# EAGLE design wander-v1.1 (EAGLE 9.4.2)
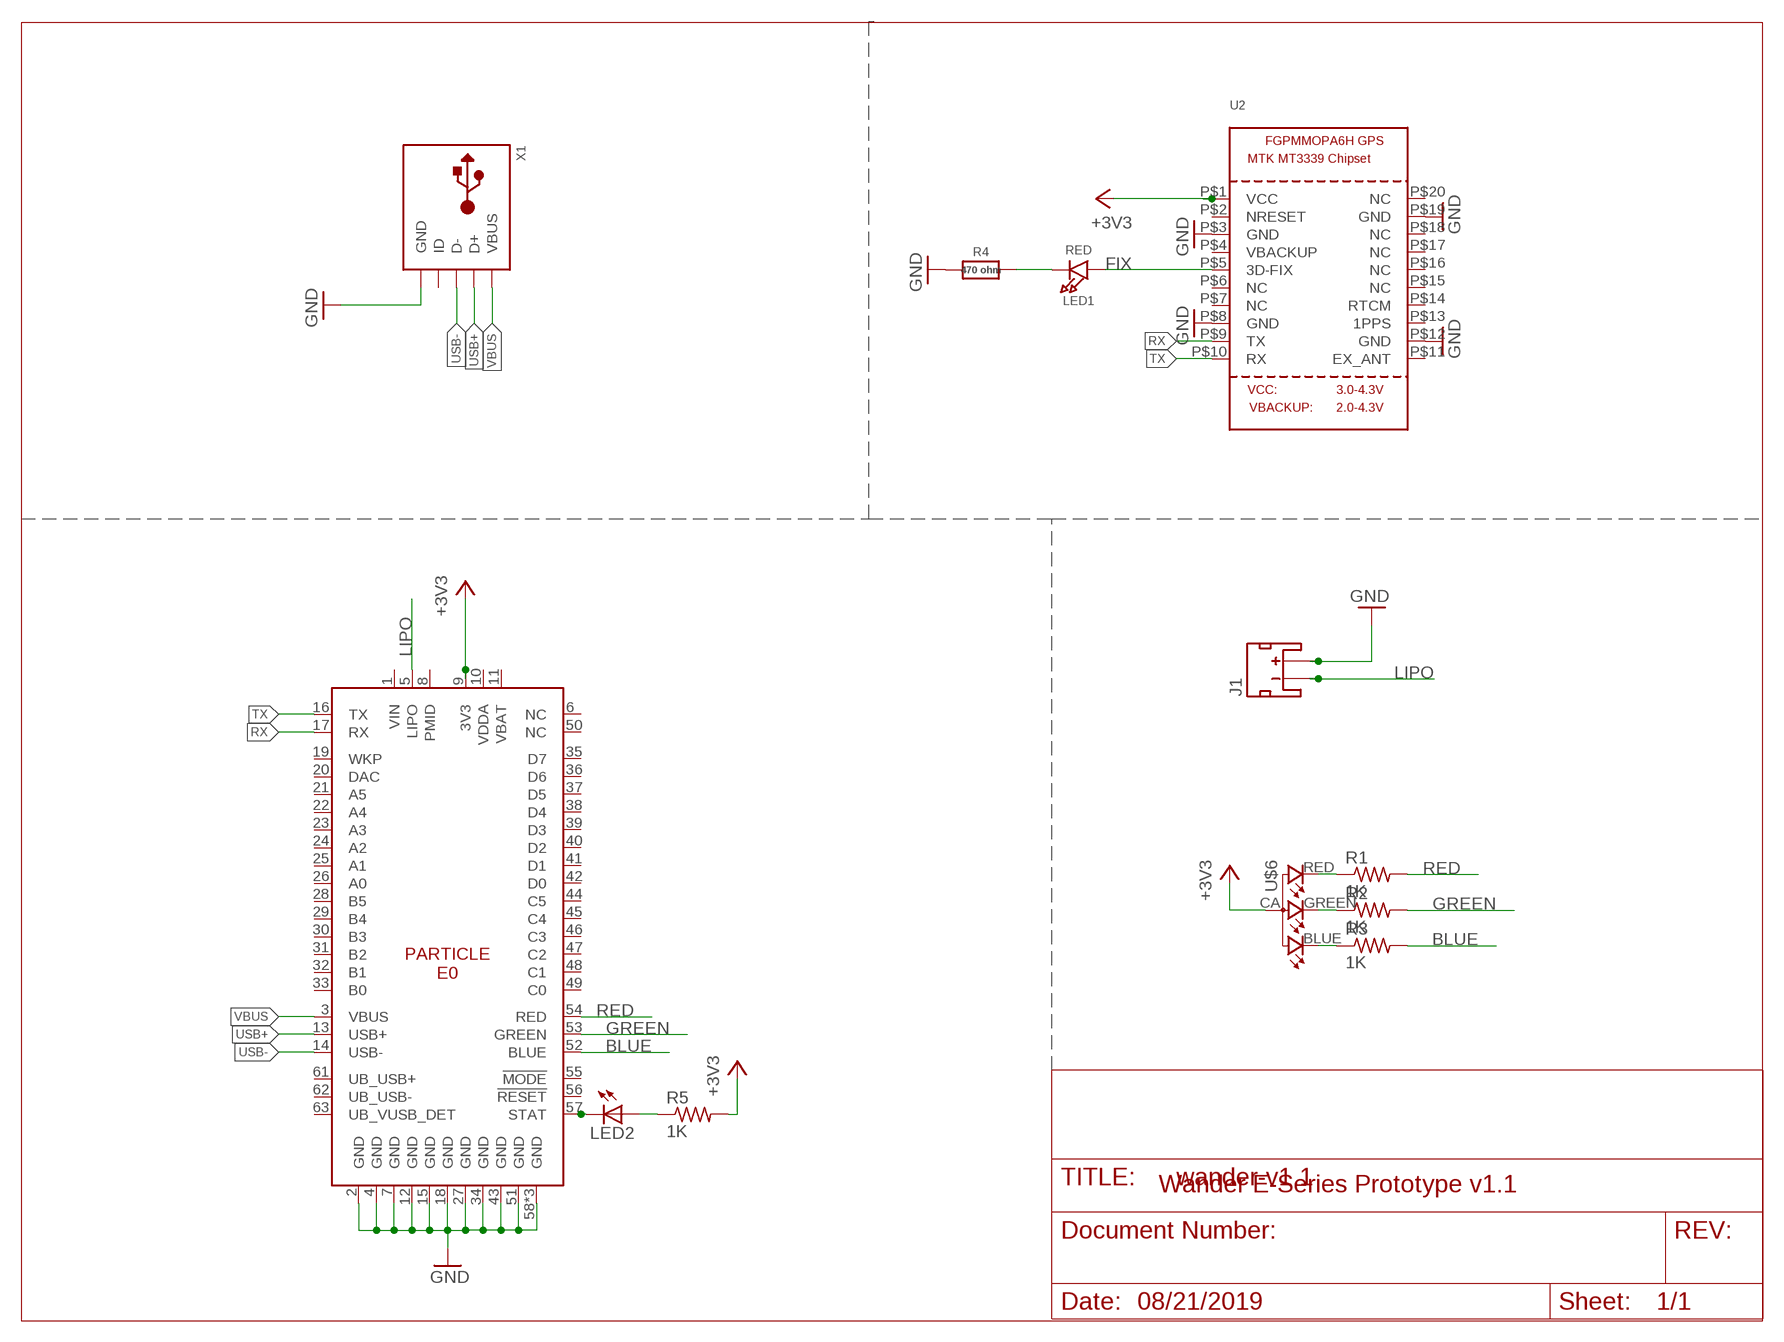
[diagram p0: schematic, sheet 1]

## Parts
J1  JST_2MM_MALE  [JST-2-SMD]
LED1  RED  LED0805_NOOUTLINE  [CHIPLED_0805_NOOUTLINE]
LED2  LED0603  [LED-0603]
R1  1K  R-US_R0603  [R0603]
R2  1K  R-US_R0603  [R0603]
R3  1K  R-US_R0603  [R0603]
R4  470 ohm  RESISTOR0805_NOOUTLINE  [0805-NO]
R5  1K  R-US_R0603  [R0603]
U1  E0_V005  [E0]
U2  GPS_FGPMMOPA6H  [FGPMMOPA6H]
U$6  RGB-LED-CLMVB-FKARGB  [PLCC4-2MM-RGB]
X1  USB-NEW-PHOTON  [4UCONN_CMCUSB-5BFM14X-01-X]

## Nets
+3V3 [3V3]: R5.2 U1.9(3V3) U2.P$1(VCC) U$6.CA
BLUE: R3.2 U1.52(BLUE)
FIX: LED1.A U2.P$5(3D-FIX)
GND: J1.2(+) R4.1 U1.2(GND) U1.4(GND) U1.7(GND) U1.12(GND) U1.15(GND) U1.18(GND) U1.27(GND) U1.34(GND) U1.43(GND) U1.51(GND) U1.58(GND) U1.59(GND) U1.60(GND) U2.P$3(GND) U2.P$8(GND) U2.P$12(GND) U2.P$19(GND) X1.P$1(GND) X1.P$6(GND) X1.P$7(GND) X1.P$8(GND) X1.P$9(GND) X1.P$10(GND) X1.P$11(GND)
GREEN: R2.2 U1.53(GREEN)
LIPO: J1.1(-) U1.5(LIPO)
N$1: R1.1 U$6.RED
N$2: R2.1 U$6.GREEN
N$3: R3.1 U$6.BLUE
N$4: LED1.C R4.2
N$12: LED2.A R5.1
N$19: LED2.C U1.57(STAT)
RED: R1.2 U1.54(RED)
RX: U1.17(RX) U2.P$9(TX)
TX: U1.16(TX) U2.P$10(RX)
USB+: U1.13(USB+) X1.P$3(D+)
USB-: U1.14(USB-) X1.P$4(D-)
VBUS: U1.3(VBUS) X1.P$5(VBUS)
Unconnected: J1.NC1(PAD1) J1.NC2(PAD2) U1.1(VIN) U1.6(NC) U1.8(PMID) U1.10(VDDA) U1.11(VBAT) U1.19(WKP) U1.20(DAC) U1.21(A5) U1.22(A4) U1.23(A3) U1.24(A2) U1.25(A1) U1.26(A0) U1.28(B5) U1.29(B4) U1.30(B3) U1.31(B2) U1.32(B1) U1.33(B0) U1.35(D7) U1.36(D6) U1.37(D5) U1.38(D4) U1.39(D3) U1.40(D2) U1.41(D1) U1.42(D0) U1.44(C5) U1.45(C4) U1.46(C3) U1.47(C2) U1.48(C1) U1.49(C0) U1.50(NC) U1.55(!MODE) U1.56(!RESET) U1.61(UB_USB+) U1.62(UB_USB-) U1.63(UB_VUSB_DET) U2.P$2(NRESET) U2.P$4(VBACKUP) U2.P$6(NC) U2.P$7(NC) U2.P$11(EX_ANT) U2.P$13(1PPS) U2.P$14(RTCM) U2.P$15(NC) U2.P$16(NC) U2.P$17(NC) U2.P$18(NC) U2.P$20(NC) X1.P$2(ID)

## Notes on the sheet
- Wander E-Series Prototype v1.1
- 08/21/2019

## Library data of the parts
J1 = SparkFun-Connectors:JST_2MM_MALE: JST 2MM MALE RA CONNECTOR Two pin, compact surface mount connector. Commonly used as a battery input connection point. We really like the solid locking feeling and high current rating on these small connectors. We use these all the time as battery connectors. Mates to single-cell LiPo batteries. Here is the connector we sell at SparkFun: JST Right Angle Connector - White <https://www.sparkfun.com/products/8612> (PRT-08612) Datasheet <http://www.sparkfun.com/datasheets/Prototyping/Connectors/JST-Horizontal.pdf> It was used on these SparkFun products: SparkFun MOSFET Power Controller <https://www.sparkfun.com/products/11214> (PRT-11214) SparkFun Battery Babysitter - LiPo Battery Manager <https://www.sparkfun.com/products/13777> (PRT-13777) And many, many others that required a lipo battery connection.; PROD_ID: CONN-11443; SF_ID: PRT-08612
LED1 = microbuilder:LED: LED 0603 - 0603 Surface Mount Package 2mA: Green LED - Low Power (3.9mcd, 2ma, 1.7Vf) - Digikey: 475-2709-2-ND Orange LED - Low Power (9.8mcd, 2ma, 1.8Vf) - Digikey: 475-1194-2-ND Red LED - Low Power (5mcd, 2ma, 1.8Vf) - Digikey: 475-1195-2-ND Yellow LED - Low Power (7mcd, 2ma, 1.8Vf) - Digikey: 475-1196-2-ND 5mA: Blue LED - Low Power (17mcd, 5ma, 2.9Vf) - Digikey: LNJ937W8CRACT-ND 0805 - 0805 Surface Mount Package 2mA: Red LED (8.8mcd, 2mA, 1.8Vf, Clear) - Low Power [Digikey: 475-2510-1-ND] Green LED (5mcd, 2mA, 1.8Vf, Clear) - Low Power [Digikey: 475-2730-1-ND] Yellow LED (11.3mcd, 2mA, 1.8Vf, Clear) - Low Power [Digikey: 475-2555-1-ND] 20mA: Red LED (104mcd, 20mA, Diffused) - LS R976 [Digikey: 475-1278-6-ND] Red LED (12mcd, 20mA, 2.0Vf, Clear) - APT2012EC [Digikey: 754-1128-1-ND] Green LED (15mcd, 20mA, 2.2Vf, Clear) - APT2012GC [Digikey: 754-1131-1-ND] Orange LED (160mcd, 20mA, 2.1Vf, Clear) - APT2012SECK [Digikey: 754-1130-1-ND] 1206 - 1206 Surface Mount Package Green LED (26mcd, 20mA, Diffused) - LG N971 [Digikey: 475-1407-6-ND] Red LED (15mcd, 20mA, Diffused) - LH N974 [Digikey: 475-1416-6-ND] Cree - Cree High-Power Surface Mount LEDs XPEBWT-L1-0000-00D50 - White 111lm 350mA 2.9Vf 6200K 110° XTEAWT-00-0000-00000LEE3 - White 114lm 350mA 2.85Vf 5000K 115° Everlight - Everlight 45-21 Series Surface Mount LEDs 45-21/QK2C-B2832AC2CB2/2T - Warm White 2000mcd 20mA 3.25Vf 3050K 120° 45-21/LK2C-B38452C4CB2/2T - Nuetral White 2000mcd 20mA 3.25Vf 4150K 120° 45-21/LK2C-B50634C6CB2/2T - Cold White 2200mcd 20mA 3.25Vf 5650K 120° PLCC2 Reverse Mount LS T77K-J1L2-1-0-2-R18-Z - Red 11.25mcd 2mA 1.8Vf 630nm 120° LO T77K-L1M2-24-Z - Orange 19.6mcd 2mA 1.8Vf 606nm 120° LY T77K-K2M1-26-Z - Yellow 15.7mcd 2mA 1.8Vf 587nm 120°
LED2 = SparkFun:LED: LEDs Standard schematic elements and footprints for 5mm, 3mm, 1206, and 0603 sized LEDs. 5mm - Spark Fun Electronics SKU : COM-00529 (and others)
R1-R3 R5 = rcl:R-US_: RESISTOR, American symbol
R4 = microbuilder:RESISTOR: Resistors For new designs, use the packages preceded by an '_' character since they are more reliable: The following footprints should be used on most boards: _0402 - Standard footprint for regular board layouts _0603 - Standard footprint for regular board layouts _0805 - Standard footprint for regular board layouts _1206 - Standard footprint for regular board layouts For extremely tight-pitch boards where space is at a premium, the following 'micro-pitch' footprints can be used (smaller pads, no silkscreen outline, etc.): _0402MP - Micro-pitch footprint for very dense/compact boards _0603MP - Micro-pitch footprint for very dense/compact boards _0805MP - Micro-pitch footprint for very dense/compact boards _1206MP - Micro-pitch footprint for very dense/compact boards
U1 = Particle-Devices:E0: Particle’s E Series module platform is the World’s simplest solution for developing and deploying cellular-connected IoT products. Product Page : Datasheet <https://docs.particle.io/datasheets/electron-(cellular)/e-series-datasheet/> Github : Particle devices library <https://github.com/particle-iot/hardware-libraries/tree/master/Eagle>
U2 = adafruit:GPS_FGPMMOPA6H: GPS Module - MTK MT3339 Chipset, -165dBm sensitivity, 22 channels, 10Hz, auto-select external antenna options
U$6 = Particle:RGB-LED-CLMVB-FKA: CREE CLMVB-FKA RGB LED 2mm x 2mm
X1 = Particle:USB-NEW-PHOTON: USB Connectors USBMINIB - Surface Mount Female Mini-B USB Connector 4UConnector: 06564 Micro USB Conn with through hole tabs Part# 10103594-0001LF / MFG: (Amphenol FCI)

## Net classes
4 3V3: width 0.305 mm, clearance 0.508 mm

## Board
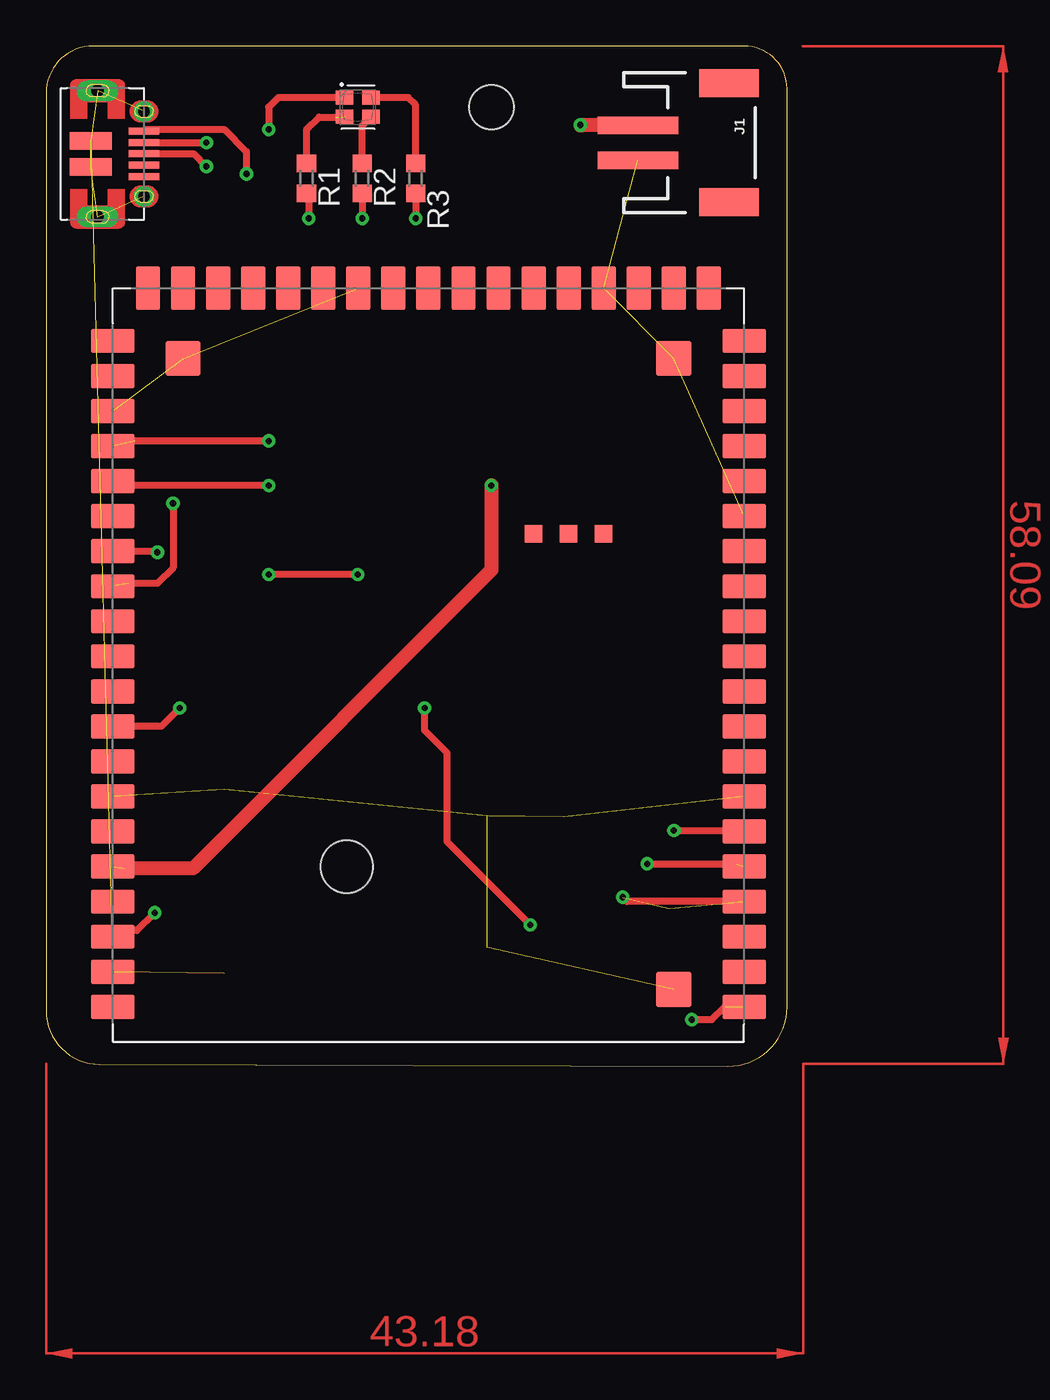
[diagram p1: board, top side]
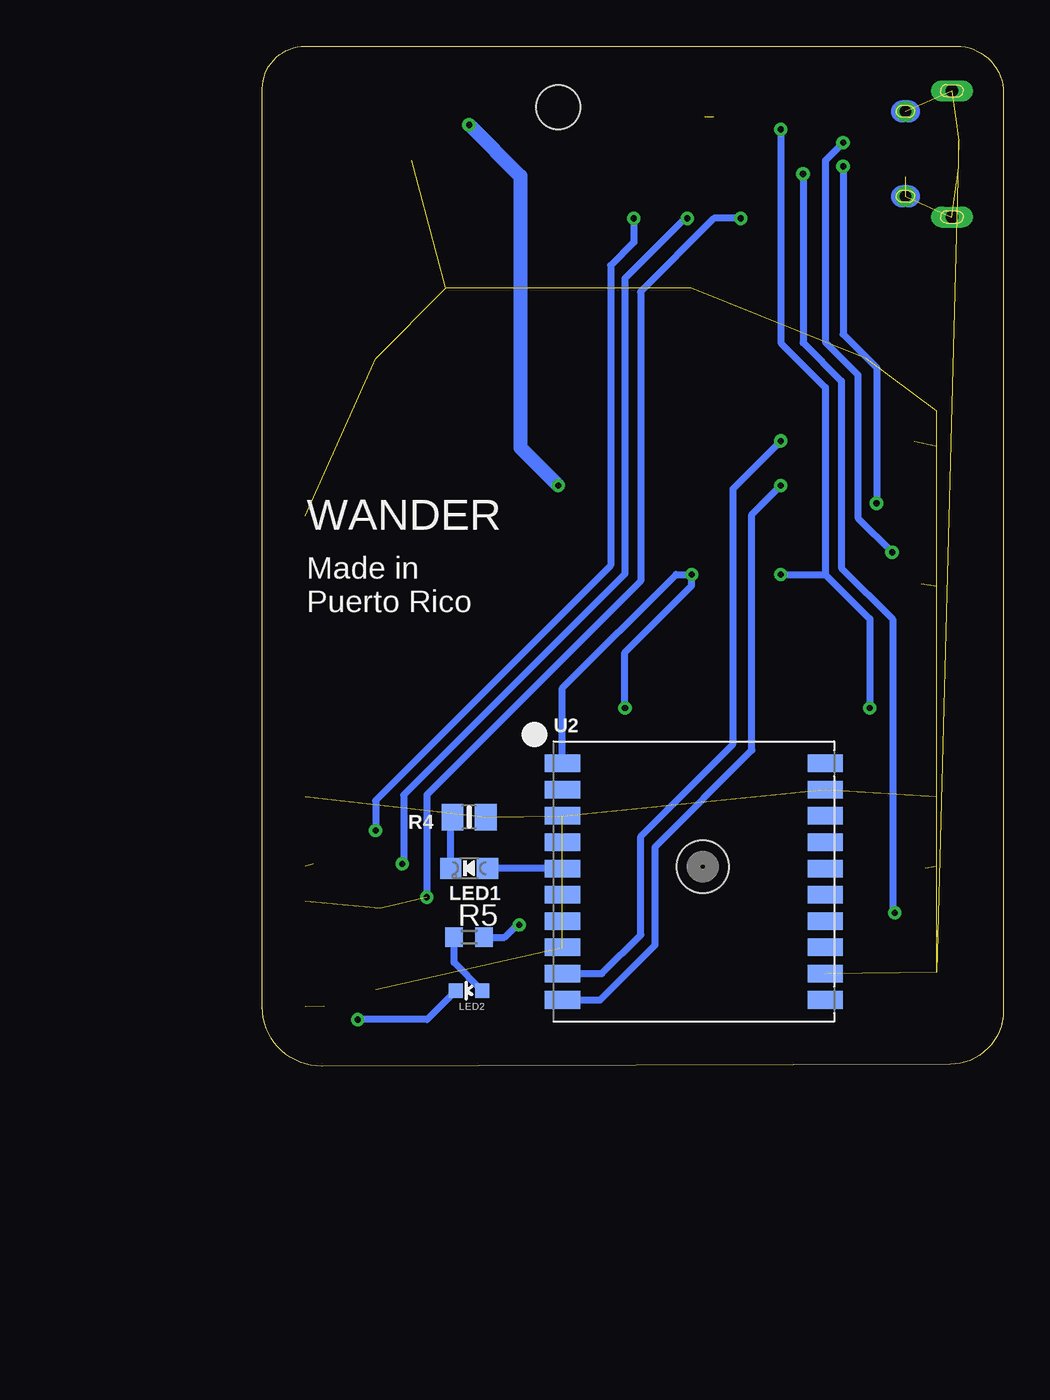
[diagram p2: board, bottom side, seen from below]

Size 42.27 x 58.21 mm. Coordinates in mm from the lower left corner, seen from the top.
Outline: 39.84,58.21 2.67,58.21 arc90 0,55.54 0,3.16 arc90 3.04,0.11 38.89,0 arc90 42.27,3.37 42.27,55.78 arc90 39.84,58.21
Copper layers (1*16): Top 0.035mm / dielectric 1.5mm / Bottom 0.035mm
Design rules "default": minimum track width 6mil, minimum drill 0.35mm, track to track 6mil, track to pad 6mil, pad to pad 6mil, via to via 6mil, smd to smd 6mil, copper to edge 40mil, drill to drill 6mil, minimum pad ring 10mil, minimum via ring 8mil, stop-mask expansion 4mil, vias tented up to drill 0mil, thermal gap 10mil
Holes 2.54 mm at 25.4,54.73

### Footprints (pad centres in the part's own frame; a part is rotated, then mirrored left to right if it is on the bottom)
JST-2-SMD = smd 1 x 4.6: 1 -1,-3.7; 2 1,-3.7 | smd 1.6 x 3.4: NC1 -3.4,1.5; NC2 3.4,1.5
CHIPLED_0805_NOOUTLINE = smd 1.2 x 1.2: A 0,-1.05; C 0,1.05
LED-0603 = smd 0.8 x 0.8: A 0,-0.75; C 0,0.75
R0603 = smd 1 x 1.1: 1 -0.85,0; 2 0.85,0
0805-NO = smd 1.24 x 1.5: 1 -0.95,0; 2 0.95,0
E0 = smd 2.5 x 1.4: 1 -0.008,2; 2 -0.008,4; 3 -0.008,6; 4 -0.008,8; 5 -0.008,10; 6 -0.008,12; 7 -0.008,14; 8 -0.008,16; 9 -0.008,18; 10 -0.008,20; 11 -0.008,22; 12 -0.008,24; 13 -0.008,26; 14 -0.008,28; 15 -0.008,30; 16 -0.008,32; 17 -0.008,34; 18 -0.008,36; 19 -0.008,38; 20 -0.008,40; 38 36.008,40; 39 36.008,38; 40 36.008,36; 41 36.008,34; 42 36.008,32; 43 36.008,30; 44 36.008,28; 45 36.008,26; 46 36.008,24; 47 36.008,22; 48 36.008,20; 49 36.008,18; 50 36.008,16; 51 36.008,14; 52 36.008,12; 53 36.008,10; 54 36.008,8; 55 36.008,6; 56 36.008,4; 57 36.008,2 | smd 1.4 x 2.5: 21 2,43.008; 22 4,43.008; 23 6,43.008; 24 8,43.008; 25 10,43.008; 26 12,43.008; 27 14,43.008; 28 16,43.008; 29 18,43.008; 30 20,43.008; 31 22,43.008; 32 24,43.008; 33 26,43.008; 34 28,43.008; 35 30,43.008; 36 32,43.008; 37 34,43.008 | smd 2 x 2: 58 32,3; 59 32,39; 60 4,39 | smd 1 x 1: 61 24,29; 62 26,29; 63 28,29
FGPMMOPA6H = smd 2 x 1: P$1 -7.5,6.75; P$2 -7.5,5.25; P$3 -7.5,3.75; P$4 -7.5,2.25; P$5 -7.5,0.75; P$6 -7.5,-0.75; P$7 -7.5,-2.25; P$8 -7.5,-3.75; P$9 -7.5,-5.25; P$10 -7.5,-6.75; P$11 7.5,-6.75; P$12 7.5,-5.25; P$13 7.5,-3.75; P$14 7.5,-2.25; P$15 7.5,-0.75; P$16 7.5,0.75; P$17 7.5,2.25; P$18 7.5,3.75; P$19 7.5,5.25; P$20 7.5,6.75 | hole 3: 0.5,0.85
PLCC4-2MM-RGB = smd 1 x 0.8: BLUE -0.75,-0.55; CA 0.75,-0.55; GREEN -0.75,0.55; RED 0.75,0.55
4UCONN_CMCUSB-5BFM14X-01-X = smd 0.4 x 1.75: P$1 -1.3,0; P$2 -0.65,0; P$3 0,0; P$4 0.65,0; P$5 1.3,0 | drill 0.65: P$6 2.425,0; P$7 -2.425,0 | drill 0.7 long: P$8 3.6,2.65; P$9 -3.6,2.65 | smd 1 x 2.4: P$10 0.75,3.035; P$11 -0.75,3.035

### Placement (x,y rotation side)
J1  37.47,52.69 270 top
LED1  30.48,11.29 90 bottom
LED2  30.48,4.31 90 bottom
R1  14.86,50.66 270 top
R2  18.03,50.66 270 top
R3  21.08,50.66 270 top
R4  30.48,14.21 180 bottom
R5  30.48,7.36 0 bottom
U1  3.81,1.39 0 top
U2  17.65,10.53 0 bottom
U$6  17.78,54.73 180 top
X1  5.59,52.06 90 top

### Tracks (layer width: path | path; a pad name or v marks a point on that pad's centre or on a via)
+3V3  (via drill 0.35)
  Top 0.406: v7.62,20.44 6.57,19.39 U1.9 | U$6.CA 13.25,55.28 12.7,54.73 v12.7,53.46 | v17.78,28.06 v12.7,28.06 | v27.62,8.05 22.86,12.82 22.86,17.9 21.59,19.17 v21.59,20.44
  Bottom 0.406: v12.7,53.46 12.7,41.26 10.16,38.72 10.16,28.06 | 10.16,28.06 7.62,25.52 v7.62,20.44 | U2.P$1 25.15,21.57 18.67,28.06 v17.78,28.06 17.78,27.42 21.59,23.61 v21.59,20.44 | v12.7,28.06 10.16,28.06 | R5.2 28.45,7.36 27.69,8.12 v27.62,8.05
BLUE  (via drill 0.35)
  Top 0.406: v35.81,13.45 39.75,13.45 U1.52 | R3.2 v21.08,48.38
  Bottom 0.406: v21.08,48.38 21.08,47.01 22.4,45.69 22.4,28.57 35.81,15.16 v35.81,13.45
FIX
  Bottom 0.406: U2.P$5 25.16,11.29 LED1.A
GND  (25 unrouted)
GREEN  (via drill 0.35)  (1 unrouted)
  Top 0.406: v34.29,11.55 39.37,11.55 | R2.2 v18.03,48.38
  Bottom 0.406: v18.03,48.38 18.16,48.38 21.59,44.95 21.59,28.08 34.21,15.46 34.21,11.62 v34.29,11.55
LIPO  (via drill 0.35)  (1 unrouted)
  Top 0.813: J1.1 30.5,53.69 v30.48,53.71 | v25.4,33.14 25.4,28.31 8.38,11.29 4.45,11.29
  Bottom 0.813: v30.48,53.71 27.56,50.79 27.56,35.3 v25.4,33.14
N$1  (2 unrouted)
  Top 0.406: R1.1 14.86,53.46 15.57,54.17 17.03,54.17
N$2
  Top 0.406: R2.1 18.03,53.68 U$6.GREEN
N$3
  Top 0.406: R3.1 21.08,54.85 20.66,55.28 U$6.BLUE
N$4
  Bottom 0.406: LED1.C 31.53,14.11 R4.2
N$12
  Bottom 0.406: LED2.A 31.33,5.91 R5.1
N$19  (via drill 0.35)  (1 unrouted)
  Top 0.406: v36.83,2.66 37.97,2.66 38.73,3.42
  Bottom 0.406: LED2.C 32.88,2.66 v36.83,2.66
RED  (via drill 0.35)  (2 unrouted)
  Top 0.406: 40.51,9.39 33.15,9.39 v32.89,9.64 | R1.2 14.99,49.69 v14.99,48.38
  Bottom 0.406: v14.99,48.38 16.51,48.38 20.7,44.19 20.7,27.68 32.89,15.48 v32.89,9.64
RX  (via drill 0.35)  (1 unrouted)
  Top 0.406: v12.7,35.68 5.08,35.68
  Bottom 0.406: U2.P$9 22.9,5.28 20.68,7.5 20.68,13.12 15.42,18.39 15.42,32.96 v12.7,35.68
TX  (via drill 0.35)  (1 unrouted)
  Top 0.406: v12.7,33.14 3.81,33.14
  Bottom 0.406: U2.P$10 23.01,3.78 19.87,6.91 19.87,12.51 14.35,18.03 14.35,31.49 v12.7,33.14
USB+  (via drill 0.35)  (1 unrouted)
  Top 0.406: X1.P$3 8.43,52.06 v9.14,51.34 | v7.24,32.12 7.24,28.44 6.35,27.55 4.7,27.55
  Bottom 0.406: v9.14,51.34 9.14,41.77 7.24,39.87 v7.24,32.12
USB-  (via drill 0.35)
  Top 0.406: U1.14 6.29,29.39 v6.35,29.33 | X1.P$4 9.13,52.71 v9.14,52.69
  Bottom 0.406: v9.14,52.69 10.16,51.68 10.16,41.32 8.31,39.46 8.31,31.28 v6.35,29.33
VBUS  (via drill 0.35)  (1 unrouted)
  Top 0.406: X1.P$5 5.68,53.46 10.16,53.46 11.43,52.19 v11.43,50.92 | v6.2,8.75 5.18,7.74 3.81,7.74
  Bottom 0.406: v11.43,50.92 11.43,41.29 9.25,39.1 9.25,28.44 6.33,25.51 6.33,8.88 v6.2,8.75
(copper drawn outside any net)
  shapes: Top area x2

### Text on the board
bNames: WANDER | Made in / Puerto Rico